# EAGLE design Pakfa (EAGLE 9.0.1)
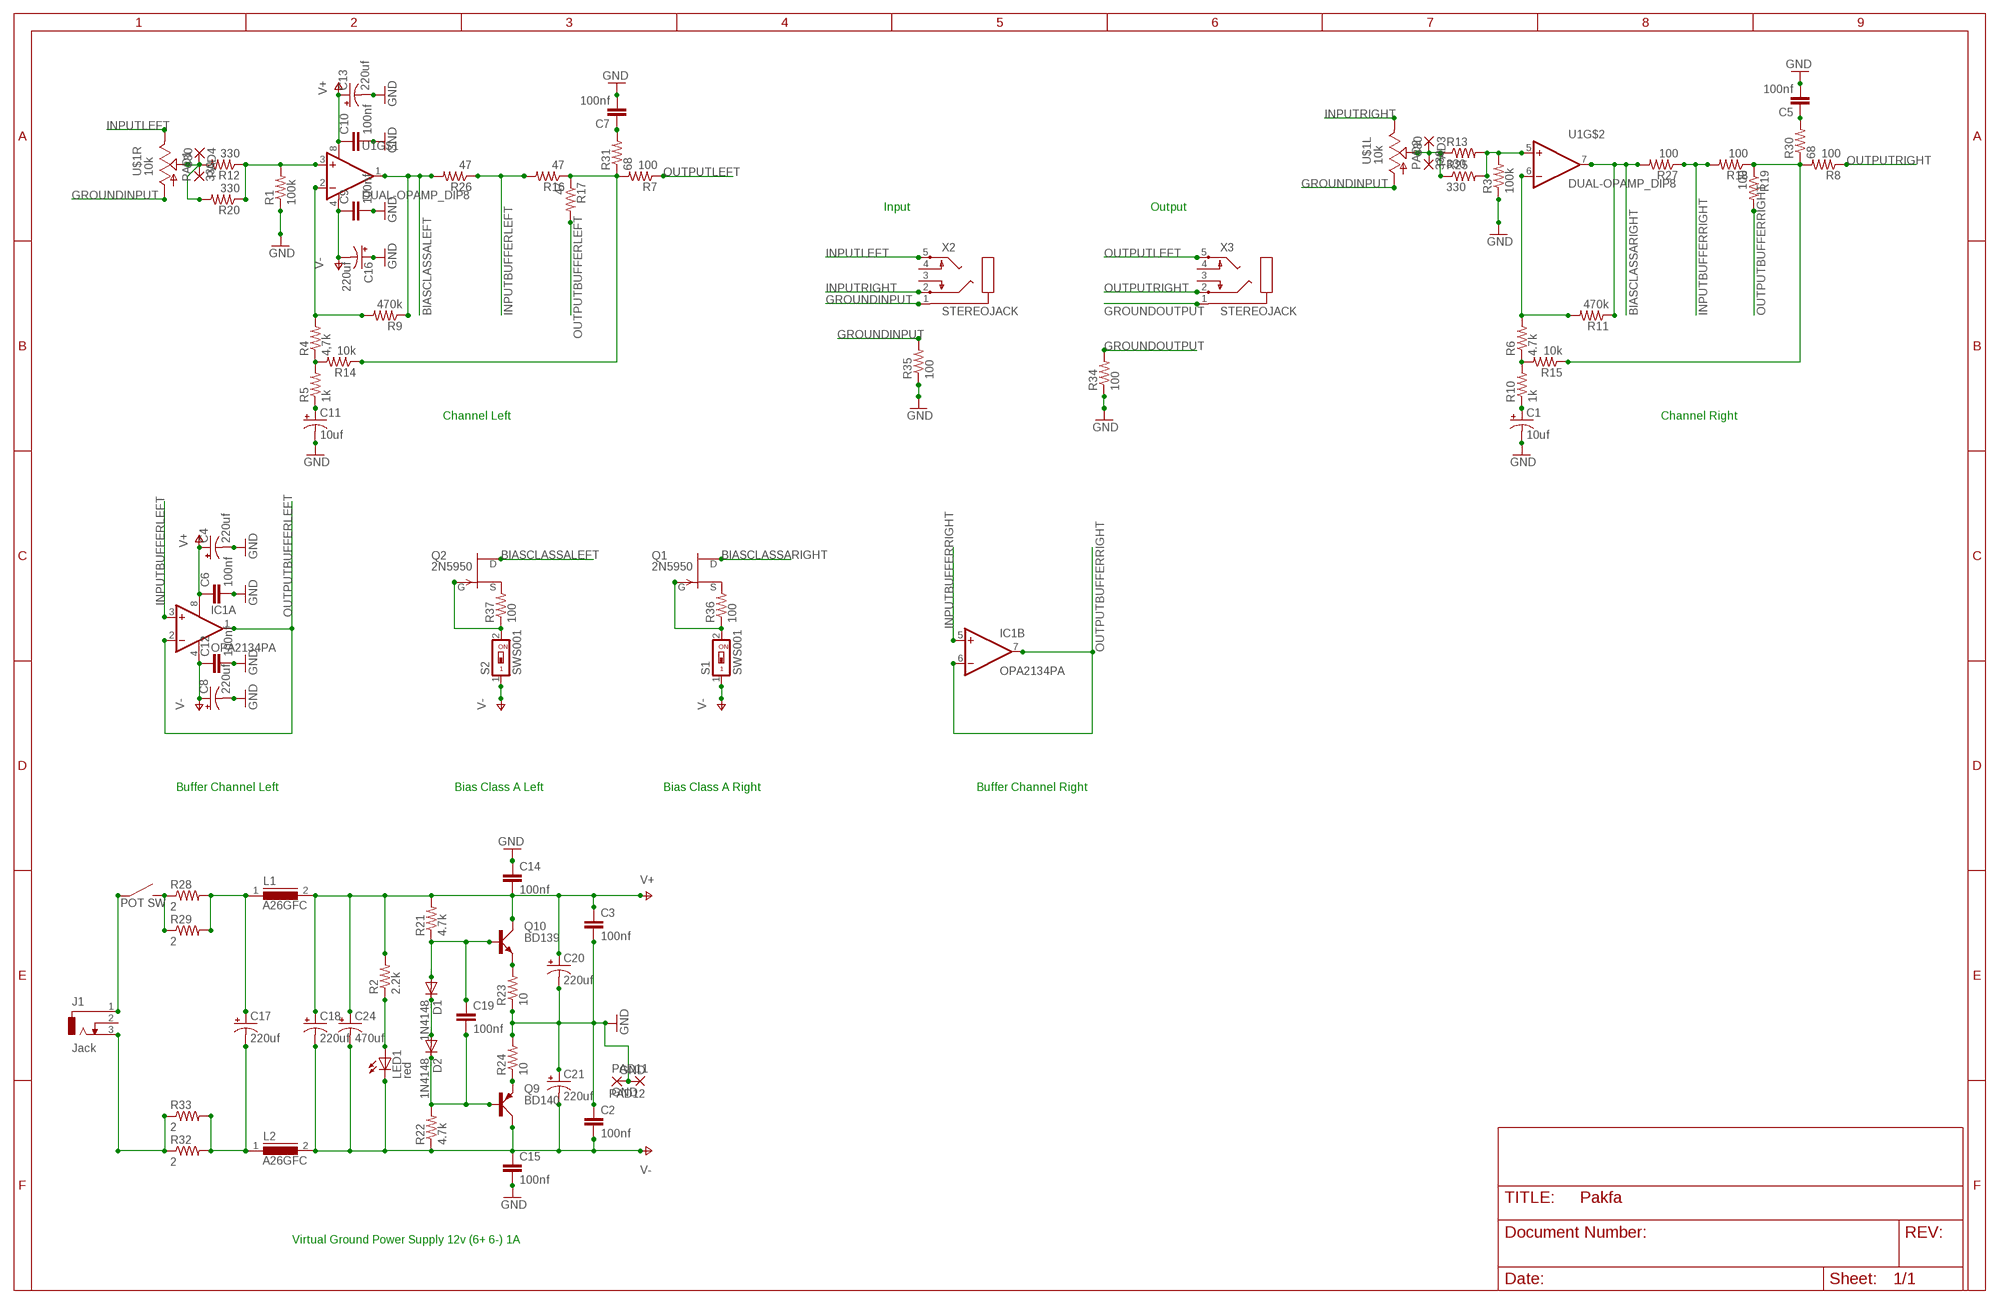
[diagram p0: schematic, sheet 1]

## Parts
C1  10uf  CPOL-USE5-10.5  [E5-10,5]
C2  100nf  C5/2.5  [C5B2.5]
C3  100nf  C5/2.5  [C5B2.5]
C4  220uf  CPOL-USE5-10.5  [E5-10,5]
C5  100nf  C5/2.5  [C5B2.5]
C6  100nf  C5/2.5  [C5B2.5]
C7  100nf  C5/2.5  [C5B2.5]
C8  220uf  CPOL-USE5-10.5  [E5-10,5]
C9  100nf  C5/2.5  [C5B2.5]
C10  100nf  C5/2.5  [C5B2.5]
C11  10uf  CPOL-USE5-10.5  [E5-10,5]
C12  100nf  C5/2.5  [C5B2.5]
C13  220uf  CPOL-USE5-10.5  [E5-10,5]
C14  100nf  C5/2.5  [C5B2.5]
C15  100nf  C5/2.5  [C5B2.5]
C16  220uf  CPOL-USE5-10.5  [E5-10,5]
C17  220uf  CPOL-USE2.5-7  [E2,5-7]
C18  220uf  CPOL-USE2.5-7  [E2,5-7]
C19  100nf  C5/2.5  [C5B2.5]
C20  220uf  CPOL-USE2.5-7  [E2,5-7]
C21  220uf  CPOL-USE2.5-7  [E2,5-7]
C24  470uf  CPOL-USE5-10.5  [E5-10,5]
D1  1N4148  1N4148DO35-7  [DO35-7]
D2  1N4148  1N4148DO35-7  [DO35-7]
IC1  OPA2134PA  [DIL08]
J1  Jack  DCJ0303  [DCJ0303]
L1  A26GFC  [A26GFC]
L2  A26GFC  [A26GFC]
LED1  red  LED3MM  [LED3MM]
PAD1  330  1,6/0,9  [1,6/0,9]
PAD2  330  1,6/0,9  [1,6/0,9]
PAD3  330  1,6/0,9  [1,6/0,9]
PAD4  330  1,6/0,9  [1,6/0,9]
PAD11  GND  1,6/0,9  [1,6/0,9]
PAD12  GND  1,6/0,9  [1,6/0,9]
Q1  2N5950  [TO-92]
Q2  2N5950  [TO-92]
Q9  BD140  [TO126AV]
Q10  BD139  [TO126AV]
R1  100k  R-US_0207/10  [0207/10]
R2  2.2k  R-US_0207/10  [0207/10]
R3  100k  R-US_0207/10  [0207/10]
R4  4,7k  R-US_0207/10  [0207/10]
R5  1k  R-US_0207/10  [0207/10]
R6  4.7k  R-US_0207/10  [0207/10]
R7  100  R-US_0207/12  [0207/12]
R8  100  R-US_0207/12  [0207/12]
R9  470k  R-US_0207/10  [0207/10]
R10  1k  R-US_0207/10  [0207/10]
R11  470k  R-US_0207/10  [0207/10]
R12  330  R-US_0207/10  [0207/10]
R13  330  R-US_0207/10  [0207/10]
R14  10k  R-US_0207/12  [0207/12]
R15  10k  R-US_0207/12  [0207/12]
R16  47  R-US_0207/12  [0207/12]
R17  47  R-US_0207/12  [0207/12]
R18  100  R-US_0207/12  [0207/12]
R19  100  R-US_0207/12  [0207/12]
R20  330  R-US_0207/10  [0207/10]
R21  4.7k  R-US_0207/10  [0207/10]
R22  4.7k  R-US_0207/10  [0207/10]
R23  10  R-US_0207/10  [0207/10]
R24  10  R-US_0207/10  [0207/10]
R25  330  R-US_0207/10  [0207/10]
R26  47  R-US_0207/10  [0207/10]
R27  100  R-US_0207/10  [0207/10]
R28  2  R-US_0207/10  [0207/10]
R29  2  R-US_0207/10  [0207/10]
R30  68  R-US_0207/7  [0207/7]
R31  68  R-US_0207/7  [0207/7]
R32  2  R-US_0207/10  [0207/10]
R33  2  R-US_0207/10  [0207/10]
R34  100  R-US_0207/7  [0207/7]
R35  100  R-US_0207/7  [0207/7]
R36  100  R-US_0204/5  [0204/5]
R37  100  R-US_0204/5  [0204/5]
S1  SWS001  [SMS-001]
S2  SWS001  [SMS-001]
U1  DUAL-OPAMP_DIP8  [DIP-8]
U$1  10k  ALPS_RK0971221Z05  [ALPS_RK0971221Z0X]
X2  STEREOJACK  [STX3100]
X3  STEREOJACK  [STX3100]

## Nets
BIASCLASSALEFT: Q2.3(D) R9.1 R26.2 U1.1(OUT)
BIASCLASSARIGHT: Q1.3(D) R11.1 R27.2 U1.7(OUT)
GND: C1.- C2.1 C3.2 C4.- C5.2 C6.2 C7.2 C8.- C9.2 C10.2 C11.- C12.2 C13.- C14.1 C15.2 C16.+ C20.- C21.+ PAD11.1(P) PAD12.1(P) R1.1 R3.1 R23.1 R24.2 R34.1 R35.1
GROUNDINPUT: R35.2 U$1.G1 U$1.G2 X2.1
GROUNDOUTPUT: R34.2 X3.1
INPUTBUFFERLEFT: IC1.3(A:+IN) R16.2 R26.1
INPUTBUFFERRIGHT: IC1.5(B:+IN) R18.2 R27.1
INPUTLEFT: U$1.I2 X2.5
INPUTRIGHT: U$1.I1 X2.2
N$1: R1.2 R12.1 R20.1 U1.3(+IN)
N$2: C1.+ R10.1
N$3: PAD1.1(P) PAD4.1(P) R12.2 R20.2 U$1.O2
N$4: C11.+ R5.1
N$6: Q10.E R23.2
N$8: Q9.E R24.1
N$10: R3.2 R13.2 R25.2 U1.5(+IN)
N$11: PAD2.1(P) PAD3.1(P) R13.1 R25.1 U$1.O1
N$12: R4.1 R5.2 R14.2
N$13: R4.2 R9.2 U1.2(-IN)
N$14: R6.1 R10.2 R15.2
N$18: R6.2 R11.2 U1.6(-IN)
N$21: R28.1 R29.1 U$1.S2
N$22: J1.3 R32.1 R33.1
N$23: R8.2 R15.1 R18.1 R19.1 R30.1
N$24: R7.2 R14.1 R16.1 R17.1 R31.1
N$25: LED1.A R2.1
N$26: J1.1 U$1.S1
N$28: C5.1 R30.2
N$29: C19.1 D1.A Q10.B R21.1
N$30: C19.2 D2.C Q9.B R22.2
N$33: C17.+ L1.1 R28.2 R29.2
N$36: D1.C D2.A
N$37: C7.1 R31.2
N$40: C17.- L2.1 R32.2 R33.2
N$41: Q1.2(S) R36.2
N$43: Q2.1(G) R37.1 S2.2
N$44: Q1.1(G) R36.1 S1.2
N$45: Q2.2(S) R37.2
OUTPUTBUFFERLEFT: IC1.1(A:OUT) IC1.2(A:-IN) R17.2
OUTPUTBUFFERRIGHT: IC1.6(B:-IN) IC1.7(B:OUT) R19.2
OUTPUTLEFT: R7.1 X3.5
OUTPUTRIGHT: R8.1 X3.2
V+: C3.1 C4.+ C6.1 C10.1 C13.+ C14.2 C18.+ C20.+ C24.+ IC1.8(A:V+) L1.2 Q10.C R2.2 R21.2 U1.8(V+)
V-: C2.2 C8.+ C9.1 C12.1 C15.1 C16.- C18.- C21.- C24.- IC1.4(A:V-) L2.2 LED1.K(C) Q9.C R22.1 S1.1 S2.1 U1.4(V-)
Unconnected: J1.2 X2.3 X2.4 X3.3 X3.4

## Notes on the sheet
- Input | Output
- Channel Left | Channel Right
- Buffer Channel Left | Bias Class A Left | Bias Class A Right | Buffer Channel Right
- Virtual Ground Power Supply 12v (6+ 6-) 1A

## Library data of the parts
C1 C4 C8 C11 C13 C16-C18 C20 C21 C24 = rcl:CPOL-US: POLARIZED CAPACITOR, American symbol; SPICEPREFIX: C
C2 C3 C5-C7 C9 C10 C12 C14 C15 C19 = capacitor-wima:C: CAPACITOR naming: grid - package width
D1 D2 = diode:1N4148: DIODE high speed (Philips)
IC1 = linear:OPA2*: Dual Operational Amplifier Low Power, Single-Supply, Rail-To-Rail Operational Amplifier Source: http://focus.ti.com/lit/ds/symlink/opa2345.pdf http://focus.ti.com .. opa241.pdf http://focus.ti.com/lit/ds/symlink/opa2134.pdf
J1 = con-jack:DCJ0303: DC POWER JACK Source: DCJ0303.pdf
L1 L2 = inductors:A26GFC: INDUCTOR; SPICEPREFIX: L
LED1 = led:LED: LED OSRAM: - CHIPLED LG R971, LG N971, LY N971, LG Q971, LY Q971, LO R971, LY R971 LH N974, LH R974 LS Q976, LO Q976, LY Q976 LO Q996 - Hyper CHIPLED LW Q18S LB Q993, LB Q99A, LB R99A - SideLED LS A670, LO A670, LY A670, LG A670, LP A670 LB A673, LV A673, LT A673, LW A673 LH A674 LY A675 LS A676, LA A676, LO A676, LY A676, LW A676 LS A679, LY A679, LG A679 - Hyper Micro SIDELED® LS Y876, LA Y876, LO Y876, LY Y876 LT Y87S - SmartLED LW L88C, LW L88S LB L89C, LB L89S, LG L890 LS L89K, LO L89K, LY L89K LS L896, LA L896, LO L896, LY L896 - TOPLED LS T670, LO T670, LY T670, LG T670, LP T670 LSG T670, LSP T670, LSY T670, LOP T670, LYG T670 LG T671, LOG T671, LSG T671 LB T673, LV T673, LT T673, LW T673 LH T674 LS T676, LA T676, LO T676, LY T676, LB T676, LH T676, LSB T676, LW T676 LB T67C, LV T67C, LT T67C, LS T67K, LO T67K, LY T67K, LW E67C LS E67B, LA E67B, LO E67B, LY E67B, LB E67C, LV E67C, LT E67C LW T67C LS T679, LY T679, LG T679 LS T770, LO T770, LY T770, LG T770, LP T770 LB T773, LV T773, LT T773, LW T773 LH T774 LS E675, LA E675, LY E675, LS T675 LS T776, LA T776, LO T776, LY T776, LB T776 LHGB T686 LT T68C, LB T68C - Hyper Mini TOPLED® LB M676 - Mini TOPLED Santana® LG M470 LS M47K, LO M47K, LY M47K Source: http://www.osram.convergy.de LUXEON: - LUMILED® LXK2-PW12-R00, LXK2-PW12-S00, LXK2-PW14-U00, LXK2-PW14-V00 LXK2-PM12-R00, LXK2-PM12-S00, LXK2-PM14-U00 LXK2-PE12-Q00, LXK2-PE12-R00, LXK2-PE12-S00, LXK2-PE14-T00, LXK2-PE14-U00 LXK2-PB12-K00, LXK2-PB12-L00, LXK2-PB12-M00, LXK2-PB14-N00, LXK2-PB14-P00, LXK2-PB14-Q00 LXK2-PR12-L00, LXK2-PR12-M00, LXK2-PR14-Q00, LXK2-PR14-R00 LXK2-PD12-Q00, LXK2-PD12-R00, LXK2-PD12-S00 LXK2-PH12-R00, LXK2-PH12-S00 LXK2-PL12-P00, LXK2-PL12-Q00, LXK2-PL12-R00 Source: www.luxeon.com KINGBRIGHT: KA-3528ASYC Source: www.kingbright.com
PAD1-PAD4 PAD11 PAD12 = wirepad:1,6/0,9: THROUGH-HOLE PAD
Q1 Q2 = transistor-fet:2N5950: N-Channel JFET RF Amplifier
Q9 = transistor-power:BD140: PNP TRANSISTOR
Q10 = transistor-power:BD139: NPN TRANSISTOR
R1-R37 = resistor:R-US_: RESISTOR, American symbol
S1 S2 = smd-special:SWS001: SMD Dip Switch 1 pol.
U1 = opamps:DUAL-OPAMP: Generic 2-channel DIP-8 opamp
U$1 = audio-pots:ALPS_RK0971221Z0*: ALPS RK0971221Z Dual-gang 9mm potentiometer for volume control, with SPST switch -05 model: 10K with "volume" taper -0N model: 50K with traditional audio taper
X2 X3 = adafruit:STEREOJACK: MIC/HEADPHONE JACK Stereo jack with two switches. Kycon STX3100, CUI SJ1-3555NG and/or 4UCon 05544

## Board
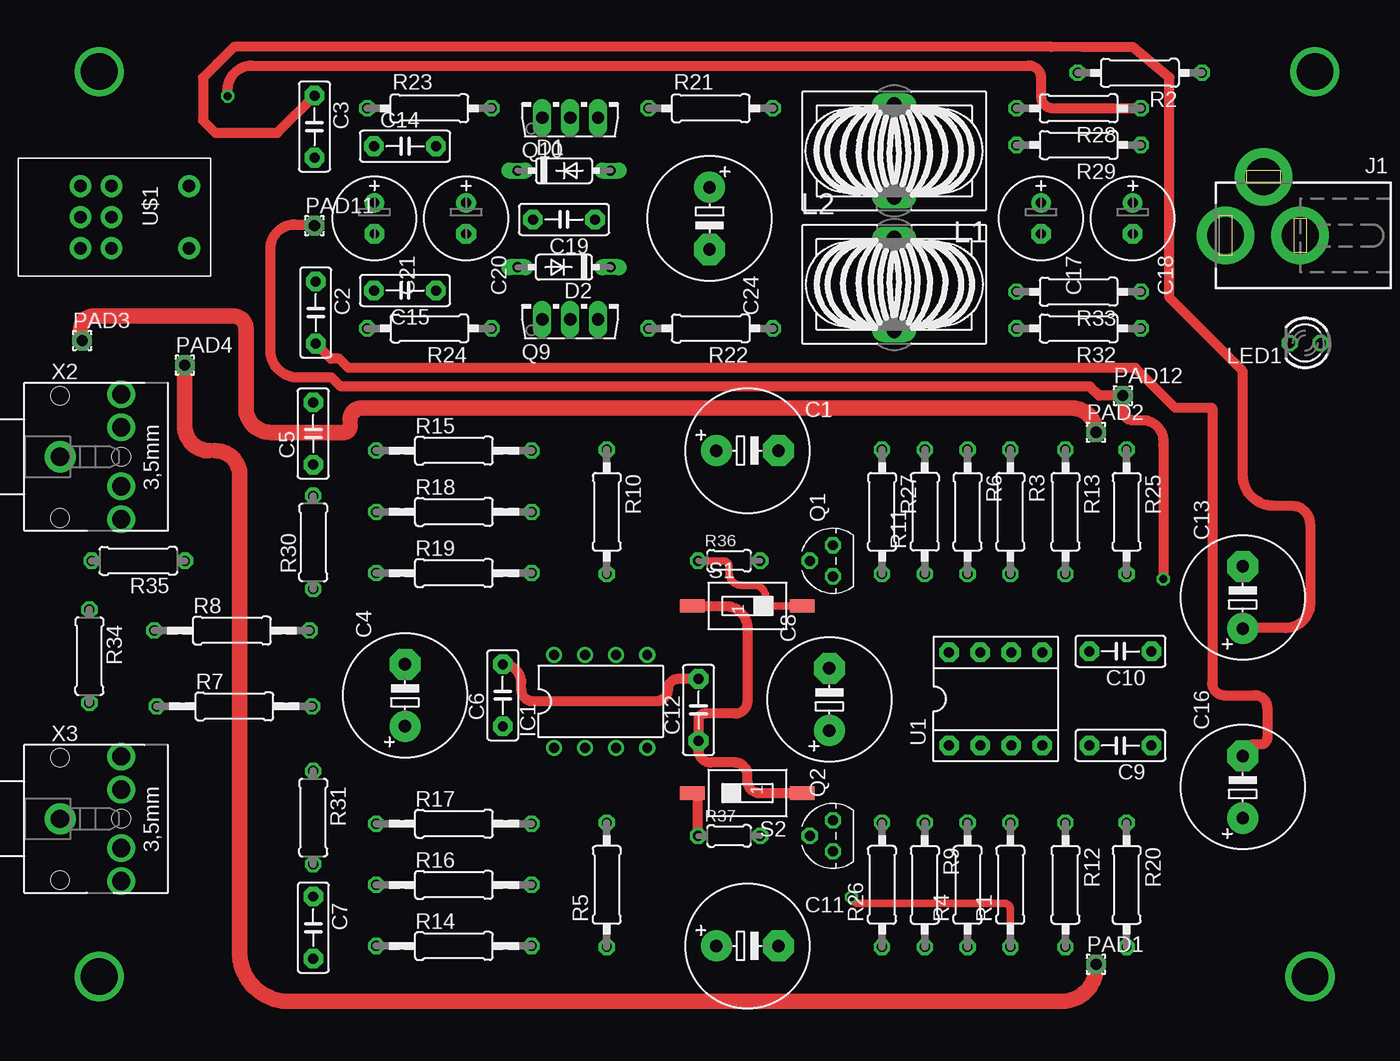
[diagram p1: board, top side]
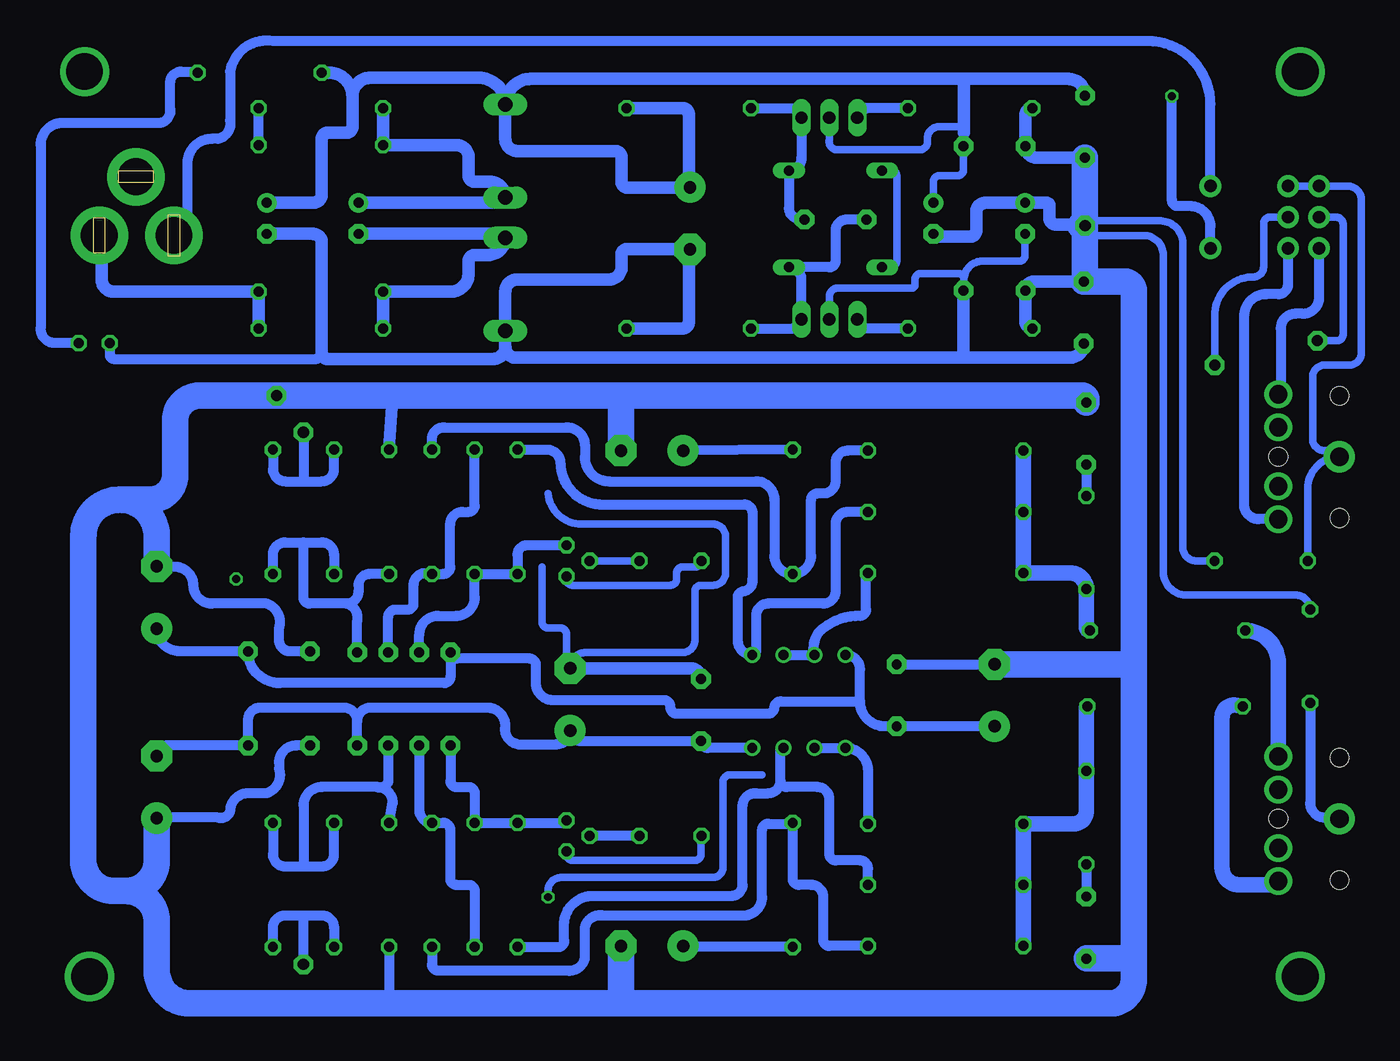
[diagram p2: board, bottom side, seen from below]

No outline drawn. Coordinates in mm, seen from the top.
Copper layers (1*16): Top 0.035mm / dielectric 1.5mm / Bottom 0.035mm
Design rules "default *": minimum track width 10mil, minimum drill 24mil, track to track 28mil, track to pad 28mil, pad to pad 28mil, via to via 28mil, smd to smd 8mil, copper to edge 40mil, drill to drill 8mil, minimum pad ring 10mil, minimum via ring 8mil, stop-mask expansion 4mil, vias tented up to drill 0mil, thermal gap 10mil

### Footprints (pad centres in the part's own frame; a part is rotated, then mirrored left to right if it is on the bottom)
E5-10,5 = drill 1.016 pad 2.54: + -2.54,0 | drill 1.016 pad 2.54 octagon: - 2.54,0
C5B2.5 = drill 0.813 pad 1.6 octagon: 1 -2.54,0; 2 2.54,0
E2,5-7 = drill 0.813 pad 1.6: + -1.27,0 | drill 0.813 pad 1.6 octagon: - 1.27,0
DO35-7 = drill 0.813 long: A 3.81,0; C -3.81,0
DIL08 = drill 0.813 pad 1.27: 1 -3.81,-3.81; 2 -1.27,-3.81; 3 1.27,-3.81; 4 3.81,-3.81; 5 3.81,3.81; 6 1.27,3.81; 7 -1.27,3.81; 8 -3.81,3.81
DCJ0303 = drill 3 pad 4.7: 1 0,3.1; 2 4.8,0; 3 0,-3
A26GFC = drill 1.194 long: 1 0,3.81; 2 0,-3.81
LED3MM = drill 0.813 octagon: A -1.27,0; K 1.27,0
1,6/0,9 = drill 0.914 pad 1.6 octagon: 1 0,0
TO-92 = drill 0.813 octagon: 1 -1.27,0; 2 0,1.905; 3 1.27,0
TO126AV = drill 1.016 long: B 2.286,-1.27; C 0,-1.27; E -2.286,-1.27
0207/10 = drill 0.813 octagon: 1 -5.08,0; 2 5.08,0
0207/12 = drill 0.813 octagon: 1 -6.35,0; 2 6.35,0
0207/7 = drill 0.813 octagon: 1 -3.81,0; 2 3.81,0
0204/5 = drill 0.813 octagon: 1 -2.54,0; 2 2.54,0
SMS-001 = smd 1.092 x 2.007: 1 0,-4.496; 2 0,4.496
DIP-8 = drill 0.813 pad 1.6 octagon: 1 -3.81,3.81; 2 -3.81,1.27; 3 -3.81,-1.27; 4 -3.81,-3.81; 5 3.81,-3.81; 6 3.81,-1.27; 7 3.81,1.27; 8 3.81,3.81
ALPS_RK0971221Z0X = drill 1.016 pad 1.778: G1 2.54,-2.54; G2 0,-2.54; I1 2.54,2.54; I2 0,2.54; O1 2.54,0; O2 0,0; S1 -6.35,-2.54; S2 -6.35,2.54
STX3100 = drill 1.5 pad 2.54: 1 2.7,-0.1 | drill 1.5: 2 7.7,5; 3 7.7,2.3; 4 7.7,-2.5; 5 7.7,-5.2 | hole 1.5: 2.7,4.9; 2.7,-5.1; 7.7,-0.1

### Placement (x,y rotation side)
C1  79,70 0 top
C2  43.7,81.3 270 top
C3  43.6,96.5 270 top
C4  51,50 90 top
C5  43.5,71.4 90 top
C6  59,50 90 top
C7  43.5,31 270 top
C8  85.7,49.66 90 top
C9  109.5,45.9 180 top
C10  109.5,53.6 180 top
C11  79,29.5 0 top
C12  75,48.8 90 top
C13  119.5,58 90 top
C14  51,94.9 0 top
C15  51,83.1 180 top
C16  119.5,42.5 90 top
C17  103,89 270 top
C18  110.5,89 270 top
C19  64,88.9 180 top
C20  56,89 270 top
C21  48.5,89 270 top
C24  75.9,89 270 top
D1  64,92.9 0 top
D2  64,85 180 top
IC1  67,49.5 0 top
J1  121.2,87.6 90 top
L1  91,94.51 180 top
L2  91,83.6 0 top
LED1  124.6,78.8 180 top
PAD1  107.5,28 0 top
PAD2  107.5,71.5 0 top
PAD3  24.6,79 0 top
PAD4  33,77 0 top
PAD11  43.6,88.4 0 top
PAD12  109.7,74.5 0 top
Q1  86,61 90 top
Q2  86,38.5 90 top
Q9  64.5,82 0 top
Q10  64.5,98.5 0 top
R1  100.5,34.5 90 top
R2  111.08,100.9 180 top
R3  100.5,65 270 top
R4  97,34.5 90 top
R5  67.5,34.5 90 top
R6  97,65 270 top
R7  37.05,49.1 0 top
R8  36.85,55.3 0 top
R9  93.5,34.5 270 top
R10  67.5,65 270 top
R11  93.5,65 90 top
R12  105,34.5 270 top
R13  105,65 270 top
R14  55,29.5 0 top
R15  55,70 0 top
R16  55,34.5 0 top
R17  55,39.5 0 top
R18  55,65 0 top
R19  55,60 0 top
R20  110,34.5 270 top
R21  76,98 0 top
R22  76,80 180 top
R23  53,98 0 top
R24  53,80 180 top
R25  110,65 270 top
R26  90,34.5 90 top
R27  90,65 270 top
R28  106.08,98 180 top
R29  106.08,95 180 top
R30  43.5,62.5 90 top
R31  43.5,40 270 top
R32  106.08,80 180 top
R33  106.08,83 180 top
R34  25.2,53.2 270 top
R35  29.2,61 180 top
R36  77.5,61 0 top
R37  77.5,38.5 0 top
S1  79,57.3 270 top
S2  79,42 90 top
U1  99.3,49.7 90 top
U$1  27,89.1 180 top
X2  20.1,69.6 0 top
X3  20.1,40 0 top

### Tracks (layer width: path | path; a pad name or v marks a point on that pad's centre or on a via)
BIASCLASSALEFT
  Bottom 0.813: U1.1 95.49,42.99 arc-90 95,42.5 94,42.5 arc90 93.5,42 R9.1 R26.2 86.19,39.58 arc-90 Q2.3
BIASCLASSARIGHT
  Bottom 0.813: U1.7 98.03,54.97 arc90 96.5,56.5 95,56.5 arc-90 93.5,58 R11.1 R27.2 90,61.5 arc90 89.23,62.27 Q1.3
GND  (via drill 0.65 pad 0.9)
  Top 0.61: R1.1 100.5,32.5 arc90 100,33 88,33 arc-90 v87.5,33.5
  Top 0.813: C12.2 73.34,51.34 arc90 72.5,50.5 arc-90 71.5,49.5 61.5,49.5 arc-90 60.5,50.5 60.5,51.04 arc90 C6.2 | PAD11.1 arc90 43.5,88.5 42,88.5 arc90 40,86.5 40,78 arc90 42.5,76 45,76 45.75,75.25 107.01,75.25 107.76,74.5 PAD12.1 109.7,73.3 arc90 110.5,72.5 111.5,72.5 arc-90 113,70.5 v113,59.5
  Bottom 0.61: 43.6,88.8 37.4,88.8 arc90 35.6,86.8 35.6,62 arc-90 34.4,61 R35.1 | 43.6,87.6 38.8,87.6 arc90 37.2,86 37.2,60.2 arc-90 35.4,58.2 26.39,58.2 arc90 R34.1 | 55.77,87.5 arc90 C20.- | v87.5,33.5 87.5,34 arc90 86.5,35.1 74,35.1 arc-90 73.2,36 73.2,43 arc90 72.5,43.5 70,43.5 | C12.2 75,51.5 | 87.5,66.5 arc-90 84.5,64 74,64 arc90 73,63 73,60 arc90 74,59 75,59 arc-90 75.5,58.5 75.5,54.5 arc90 76.5,53.5 84.4,53.5 arc-90 C8.- 85.2,52.2 arc90 86,53 86,55 arc-90 86.5,55.5 87.5,55.5 arc90 88,56 88,60.5
  Bottom 0.813: 81.54,74.04 arc-90 82,74.5 | C6.2 C4.- | 100.2,74.2 arc-90 100.5,74.5 | C10.2 108.6,53.6 arc90 109.5,54.5 109.5,55.5 arc-90 110.5,57.5 115,57.5 arc90 116.5,59 arc-90 118,60.5 119.46,60.5 arc90 C13.- | C9.2 108.1,45.9 arc-90 109.5,44.5 109.5,44 arc90 110.5,42 112,42 arc-90 113.5,40.5 arc90 114.5,40 119.46,40 arc-90 C16.+ | C7.2 43.46,28.5 | 81.54,24.84 81.5,24.8 | R1.1 100.5,24.8 | 39.64,52.54 arc90 39.6,52.5 | PAD11.1 43.6,88.8
  Bottom 1: R3.1 100.2,74.2
  Bottom 1.016: C8.- 75.86,52.2 arc90 C12.2 | 55,74 arc-90 55.5,74.5 | 55.77,87.5 53,87.5 arc-90 52.5,88 52.5,89.5 arc90 51.73,90.27 C21.+ 46.77,90.27 arc90 46.5,90 46.5,89 arc-90 46,88.5 44.1,88.5 arc90 44,88.4 | C2.1 47.72,83.84 arc-90 C15.2 48.46,80.54 arc-90 R24.2 | C3.2 47.52,93.96 arc90 C14.1 48.46,97.46 arc90 R23.1
  Bottom 1.93: 107.54,24.86 arc90 107.6,24.8
  Bottom 2.184: 39.6,28.5 39.6,52.5 39.6,83 arc-90 40.44,83.84 C2.1 arc-90 43.6,83.94 43.6,87.6 43.6,88 | 39.6,28.5 39.6,26.8 arc90 41.6,24.8 81.5,24.8 100.5,24.8 107.6,24.8 116.8,24.8 arc90 119.5,27.5 119.5,31.5 arc-90 122,34 | C3.2 43.6,88.8 43.6,88 | 44,88.4 arc90 43.6,88 | C5.2 arc-90 43.76,74.5 55.5,74.5 82,74.5 100.5,74.5 116,74.5 arc-90 118,72.5 118,68 arc90 120,66 122.5,66 | C1.- 81.54,74.04 | 122,34 123,34 arc90 125.5,36.5 125.5,63 arc90 122.5,66 | C16.+ 119.5,36.5 arc90 122,34 | C13.- 119.5,63 arc-90 122.5,66 | 43.46,28.5 39.6,28.5 | C11.- 81.54,24.84 | C4.- 39.64,52.54
GROUNDINPUT
  Bottom 0.61: R35.2 25.39,66.91 arc90 X2.1 arc-90 23.3,70 24,70 arc90 25,71 25,76 arc90 24,77 22,77 arc-90 21,78 21,90.5 arc-90 22.14,91.64 U$1.G1 U$1.G2
GROUNDOUTPUT
  Bottom 0.813: X3.1 arc-90 22.9,40 24,40 arc90 25.2,41.2 R34.2
INPUTBUFFERLEFT
  Bottom 0.813: R26.1 86.58,29.42 arc-90 86.2,30 86.2,31 arc90 84,33.6 72.5,33.6 arc-90 71.6,34.5 71.6,41 arc90 70.5,42 69.5,42 arc-90 68.5,43 | R16.2 61.35,35.85 arc-90 62,36.5 64,36.5 arc90 64.5,37 64.5,41.5 arc-90 65.5,42.5 68,42.5 arc90 68.5,43 | 68.5,43 68.5,45.46 arc90 IC1.3
INPUTBUFFERRIGHT
  Bottom 0.813: R18.2 63,65 arc-90 64,64 64,58.5 arc90 65,57.5 69.5,57.5 arc-90 70.5,56.5 70.5,53.62 arc90 IC1.5 arc90 72,54.5 72,58 arc90 71.5,58.5 arc-90 70.8,59.5 70.8,65 arc-90 71.5,65.6 83,65.6 arc90 86.5,69 arc-90 87.58,70.08 R27.1
INPUTLEFT
  Bottom 0.813: X2.5 29.4,64.4 arc90 30.6,65.6 30.6,81 arc90 28.8,82.8 27.8,82.8 arc-90 27,83.6 U$1.I2
INPUTRIGHT
  Bottom 0.813: U$1.I1 24.46,82.54 arc90 25.8,81.2 26.4,81.2 arc-90 27.6,80 27.6,74.8 arc90 X2.2
N$1
  Bottom 0.813: R20.1 110,37 arc-90 109,36 107.5,36 | 107.5,36 106,36 arc-90 105,37 R12.1 | U1.3 100.57,42.93 arc90 101.5,42.5 | 101.5,42.5 106,42.5 arc-90 107.5,41 107.5,36 | R1.2 100.2,41.2 arc-90 101.5,42.5
N$2
  Bottom 0.813: R10.1 C1.+
N$3
  Top 0.813: 35,70 35.5,70
  Top 1.27: PAD4.1 33,72 arc90 35,70 | 35.5,70 arc-90 37.5,68 37.5,29.5 arc90 41,25 105,25 arc90 PAD1.1
  Bottom 0.61: PAD4.1 33,81 arc90 30,84.2 29.9,84.2 arc-90 29,85 29,88.6 arc90 28.4,89.1 U$1.O2
  Bottom 0.813: R20.2 110,31 arc90 109,32 107.5,32 | 107.5,32 106,32 arc90 105,31 R12.2 | PAD1.1 107.5,32
N$4
  Bottom 0.813: R5.1 76.38,29.42 arc90 C11.+
N$6
  Bottom 0.813: R23.2 61.44,98 arc-90 Q10.E
N$8
  Bottom 0.813: R24.1 61.48,80 arc90 Q9.E
N$10
  Bottom 0.813: R25.2 110,61.5 arc90 109,62.5 107.5,62.5 | 107.5,62.5 106,62.5 arc90 105,61.5 R13.2 | U1.5 103.11,56.11 arc-90 104,57.5 | 104,57.5 107,57.5 arc90 107.5,58 107.5,62.5 | R3.2 102.08,59.92 arc-90 103,59 103,58.5 arc90 104,57.5
N$11
  Top 0.61: 24.5,79.1 arc90 PAD3.1
  Top 0.813: 46.5,72 46.5,72.5
  Top 1.27: 46.5,72 arc-90 46,71.5 40,71.5 arc-90 38,73.5 38,80 arc90 37,81 25.5,81 arc90 24.5,80 24.5,79.1 | 46.5,72.5 arc-90 47.5,73.5 105.5,73.5 arc-90 PAD2.1
  Bottom 0.61: PAD3.1 23,79 arc-90 22.5,79.5 22.5,88.5 arc-90 23.1,89.1 U$1.O1
  Bottom 0.813: R25.1 110,68.5 arc-90 109,67.5 107.5,67.5 | 107.5,67.5 106,67.5 arc-90 105,68.5 R13.1 | PAD2.1 107.5,67.5
N$12
  Bottom 0.813: R4.1 97,28 arc-90 96.5,27.5 86,27.5 arc-90 84.5,28.5 84.5,31 arc90 83,32 71.5,32 arc-90 70,33.5 70,39 arc90 69.5,39.5 67.58,39.5 arc-90 R5.2 67.5,35 arc-90 67,34.5 66,34.5 arc90 65,33.5 65,30 arc-90 64.5,29.5 R14.2
N$13
  Bottom 0.813: U1.2 98.03,40.61 arc-90 R4.2 96.08,39.58 arc90 95.5,39 95.5,35 arc-90 95,34.5 94,34.5 arc90 93.5,34 R9.2
N$14
  Bottom 0.813: R6.1 97,71 arc90 96,71.9 86,71.9 arc90 84.5,70.5 84.5,69.5 arc-90 82.5,67.5 70.5,67.5 arc90 69,66 69,61.42 arc-90 R10.2 arc-90 66,61.42 66,66 arc90 65.5,66.5 65,66.5 arc-90 64,67.5 64,69 arc90 63,70 R15.2
N$18
  Bottom 0.813: U1.6 100.57,56.43 arc90 100,57 99,57 arc-90 98.5,57.5 98.5,59 arc90 97.5,60 97.08,60 arc90 R6.2 96.08,59.92 arc-90 95.5,60.5 95.5,64 arc90 94.5,65 94,65 arc-90 93.5,65.5 R11.2
N$21  (via drill 0.65 pad 0.9)
  Top 0.813: v36.5,99 36.5,99.5 arc-90 38.5,101.5 102,101.5 arc-90 103,100.5 103,99 arc90 104,98 R28.1
  Bottom 0.813: U$1.S2 33.35,88.35 arc-90 35,90 36,90 arc90 36.5,90.5 v36.5,99 | R29.1 R28.1
N$22
  Bottom 0.61: 124,87.4 arc-90 J1.3
  Bottom 1.016: R32.1 R33.1 123,83 arc90 124,84 124,87.4
N$23
  Bottom 1.27: R15.1 R18.1 R19.1 44.81,60 arc90 R30.1 43.5,55.6 arc-90 R8.2
N$24
  Bottom 0.813: 43.5,49 arc90 R7.2
  Bottom 1.27: R14.1 R16.1 R17.1 44.5,39.5 arc-90 43.5,40.5 R31.1 43.5,49
N$25
  Bottom 0.813: 126.07,79 arc90 LED1.A 127.8,78.8 arc90 129,80 129,95 arc90 127.2,96.8 119.2,96.8 arc-90 118.4,98 118.4,100.1 arc90 117.5,101 116.26,101 arc90 R2.1
N$26
  Bottom 0.813: U$1.S1 33.35,98.35 arc-90 38.5,103.5 110,103.5 arc-90 113.5,101 113.5,97 arc90 114.5,95.5 115,95.5 arc-90 117,93.5 117,88.7 arc90 J1.1
N$27  (via drill 3 pad 3.81)
  other vias: 125,27
N$28
  Bottom 0.813: C5.1 R30.2
N$29
  Bottom 0.813: C19.1 arc-90 66.64,89 67,89 arc90 67.81,89.81 D1.A arc-90 66.79,93.92 Q10.B arc-90 67.56,98 R21.1
N$30
  Bottom 0.813: R22.2 67.52,80 arc-90 Q9.B 66.79,83.98 arc-90 D2.C 64.5,85 arc-90 64,85.5 64,88 arc90 63.1,88.9 C19.2
N$32
  cutout Bottom: 20,105 132,105 132,22 20,22
N$33
  Bottom 1.016: R28.2 R29.2 95,95 arc90 94,94 94,92.5 arc-90 93.5,92 92.3,92 arc90 L1.1 arc90 91.43,90.27 C17.+
N$34  (via drill 3 pad 3.81)
  other vias: 125.4,101
N$35  (via drill 3 pad 3.81)
  other vias: 26,101
N$36
  Bottom 0.61: D1.C 59.4,92.9 arc90 59,92.5 59,85.5 arc90 59.5,85 D2.A
N$37
  Bottom 0.813: R31.2 C7.1
N$38  (via drill 3 pad 3.81)
  other vias: 26,27
N$40
  Bottom 1.016: R32.2 R33.2 95.5,83 arc-90 94,84.5 94,85.5 arc90 93.5,86 92.41,86 arc-90 L2.1 arc-90 91.32,87.73 C17.-
N$41
  Bottom 0.61: R36.2 Q1.2
N$43
  Top 0.813: R37.1 74.96,41.54 arc90 S2.2
  Bottom 0.61: Q2.1 86,37 arc-90 85.5,36.5 75.5,36.5 arc-90 75,37 75,37.96 arc90 R37.1
  Bottom 0.813: 75,38.46 arc90 R37.1
N$44
  Top 0.61: S1.2 81.2,57.3 arc-90 80.5,58 arc90 79.5,59 78.5,59 arc-90 77.5,60 77.5,60.5 arc90 77,61 R36.1
  Bottom 0.61: Q1.1 86,59.5 arc-90 85.5,59 77.5,59 arc-90 77,59.5 77,60 arc90 76.5,60.5 75.46,60.5 arc-90 R36.1
N$45
  Bottom 0.813: R37.2 Q2.2
OUTPUTBUFFERLEFT
  Bottom 0.813: IC1.2 IC1.1 arc90 61.35,43.85 R17.2
OUTPUTBUFFERRIGHT
  Bottom 0.813: IC1.6 IC1.7 arc69 65,55.5 arc37 62,56.5 arc-90 61.5,57 61.5,59.85 arc90 R19.2
OUTPUTLEFT
  Bottom 1.27: R7.1 31.4,49.2 arc-90 32.4,48.2 32.4,35.9 arc-90 31,34.5 28.1,34.5 arc-90 X3.5
OUTPUTRIGHT
  Bottom 1.27: R8.1 arc90 27.8,52.6 X3.2
V+
  Top 0.813: C13.+ arc-90 119.54,55.5 123,55.5 arc90 125,57.5 125,64 arc90 123.5,65.5 122,65.5 arc-90 119.5,68 119.5,76.5 113.5,82.5 113.5,100.5 110.5,103 106.39,103 103.87,103.02 37.02,103.02 35.6,101.61 35.6,101.6 34.5,100.5 34.5,97 35.5,96 40.56,96 C3.1
  Bottom 0.61: 43.56,99 arc90 C3.1 | Q10.C 64.5,95.5 arc-90 64,94.6 57,94.6 arc-90 56.5,95.5 arc90 55.5,96.5 54,96.5 arc90 53.5,96 53.5,94.94 arc90 C14.2 53.54,92.96 arc90 54,92.5 55.5,92.5 arc-90 56,92 C20.+ | 75.94,91.5 arc-90 C24.+
  Bottom 0.813: C4.+ C6.1 59.96,47.46 arc90 62,49.5 | 62,49.5 62,52.12 arc-90 IC1.8 | 62,49.5 68.5,49.5 arc-90 69,49 arc90 69.5,48.5 77,48.5 arc90 77.5,49 arc-90 78,49.6 87.1,49.6 arc90 88.5,51 88.5,52.5 arc-90 89,53 94.98,53 arc90 U1.8 95.49,51.51 arc90 96,51 109.44,51 arc90 C10.1 117.64,53.6 arc90 C13.+ | 43.5,98.94 arc-90 C3.1 | 91,99 L1.2
  Bottom 1.016: C3.1 arc-90 44.96,100.4 53.5,100.4 | R21.2 76.5,98 arc90 76,97.5 76,91.64 arc-90 C24.+ | L1.2 91,95.5 arc-90 90,94.5 82,94.5 arc90 81.5,94 81.5,92 arc-90 81,91.5 75.94,91.5 | L1.2 arc90 88.92,100.4 53.5,100.4 | 53.5,96 53.5,100.4 | C18.+ 106.73,90.27 arc-90 106,91 106,95.5 arc90 105.5,96 104,96 arc-90 103.5,96.5 103.5,99 | 103.5,99 arc90 102,100.5 93.18,100.5 arc90 L1.2 | R2.2 105.4,100.9 arc90 103.5,99
V-
  Top 0.813: C2.2 44.94,77.52 45.63,77.52 46.38,76.78 110.72,76.78 114,73.5 117,73.5 117,51 arc90 118,50 120.5,50 arc-90 121.5,49 121.5,46.5 arc-90 121,46 120.46,46 arc90 C16.- | S2.1 80,42 arc-90 79,43 79,43.5 arc90 78,44.5 76,44.5 arc-90 75,45.5 C12.1 75,48 arc-90 75.5,48.5 78,48.5 arc90 79,49.5 79,55.5 arc90 77.2,57.3 S1.1
  Bottom 0.61: 103.12,46.4 arc90 U1.4 | Q9.C 64.5,82.5 arc90 63.9,83.3 57.9,83.3 arc-90 57.5,83.5 57.5,84 arc90 57,84.5 54,84.5 arc90 53.5,84 | 53.5,84 53.5,83.14 arc90 C15.1 | C21.- 48.5,86 arc90 49,85.5 52,85.5 arc-90 53.5,84 | 76,86.36 arc90 C24.- arc-90 75.94,86.5
  Bottom 0.813: U1.4 103.11,47.89 | 103.11,47.89 arc90 102,49 92.5,49 arc90 91,47.5 arc-90 90,46 86.82,46 arc-90 C8.+ arc-90 84.84,46.26 C12.1 arc-90 74.43,45.69 IC1.4 | C16.- arc90 118.64,45.9 C9.1 112.04,47.96 arc90 111,49 104.22,49 arc90 103.11,47.89 | 53.54,77.64 arc-90 53.5,77.6 | LED1.K 123.33,77.83 arc-90 123,77.5 106.5,77.5 arc-90 106,78
  Bottom 1.016: C2.2 arc90 44.86,77.6 53.5,77.6 90.1,77.6 arc90 91,78.5 | C15.1 53.54,77.64 | R22.1 76.5,80 arc-90 76,80.5 76,86.36 | 75.94,86.5 81,86.5 arc-90 81.5,86 81.5,85 arc90 82.5,84 90,84 arc-90 91,83 L2.2 91,78.5 | C18.- 106.73,87.73 arc90 106,87 106,78 arc-90 105.5,77.5 92,77.5 arc-90 91,78.5